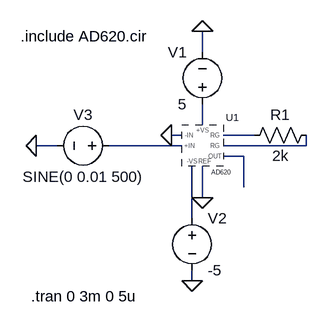
[diagram p0: schematic workingAD620Cicruit.asc]
workingAD620Cicruit.asc, the LTspice schematic file:
Version 4
SHEET 1 880 680
WIRE 160 16 160 -16
WIRE 160 128 160 96
WIRE 128 144 112 144
WIRE 240 144 192 144
WIRE -64 160 -96 160
WIRE 128 160 16 160
WIRE 320 160 320 144
WIRE 320 160 192 160
WIRE 224 176 192 176
WIRE 224 224 224 176
WIRE 160 240 160 192
WIRE 144 272 144 192
WIRE 144 368 144 352
FLAG 160 240 0
FLAG 144 368 0
FLAG 160 -16 0
FLAG -96 160 0
FLAG 112 144 0
SYMBOL res 336 128 R90
WINDOW 0 0 56 VBottom 2
WINDOW 3 32 56 VTop 2
SYMATTR InstName R1
SYMATTR Value 2k
SYMBOL Voltage 160 112 R180
WINDOW 0 24 96 Left 2
WINDOW 3 24 16 Left 2
SYMATTR InstName V1
SYMATTR Value 5
SYMBOL Voltage 144 256 R0
SYMATTR InstName V2
SYMATTR Value -5
SYMBOL Voltage 32 160 R90
WINDOW 0 -32 56 VBottom 2
WINDOW 3 32 56 VTop 2
SYMATTR InstName V3
SYMATTR Value SINE(0 0.01 500)
SYMBOL AD620 160 160 R0
WINDOW 3 14 41 Left 0
SYMATTR InstName U1
TEXT -120 -8 Left 2 !.include AD620.cir
TEXT -104 392 Left 2 !.tran 0 3m 0 5u

The netlist it stands for:
* workingAD620Cicruit.asc
R1 N004 N002 2k
V1 N001 0 5
V2 N006 0 -5
V3 N003 0 SINE(0 0.01 500)
XU1 N003 0 N001 N006 N005 0 N004 N002 AD620  ; pins +IN -IN +VS -VS OUT REF RG1 RG
.include AD620.cir
.tran 0 3m 0 5u
.backanno
.end